# Altium project SPEC_A7.PrjPcb (part 3 of 7)

## Sheet VCXO_25M_PTP.SchDoc: SPEC-A7
size 420 x 297 mm; Author: G.Kasprowicz; CompanyName: WUT ISE; DrawnBy: G.Kasprowicz; Organization: WUT ISE; Address1: PW ISE; Address2: Nowowiejska 15/19 00-665 Warsaw; Address3: gkasprow@gmail.com; Revision: 2; SheetNumber: 8; SheetTotal: 18; ModifiedBy: -; CheckedDate: -; Title2: 25MHz VCXO; DivGrp: WUT ISE; Designer: G.Kasprowicz; ModifiedDate: -; ProjectName: Sensor Box
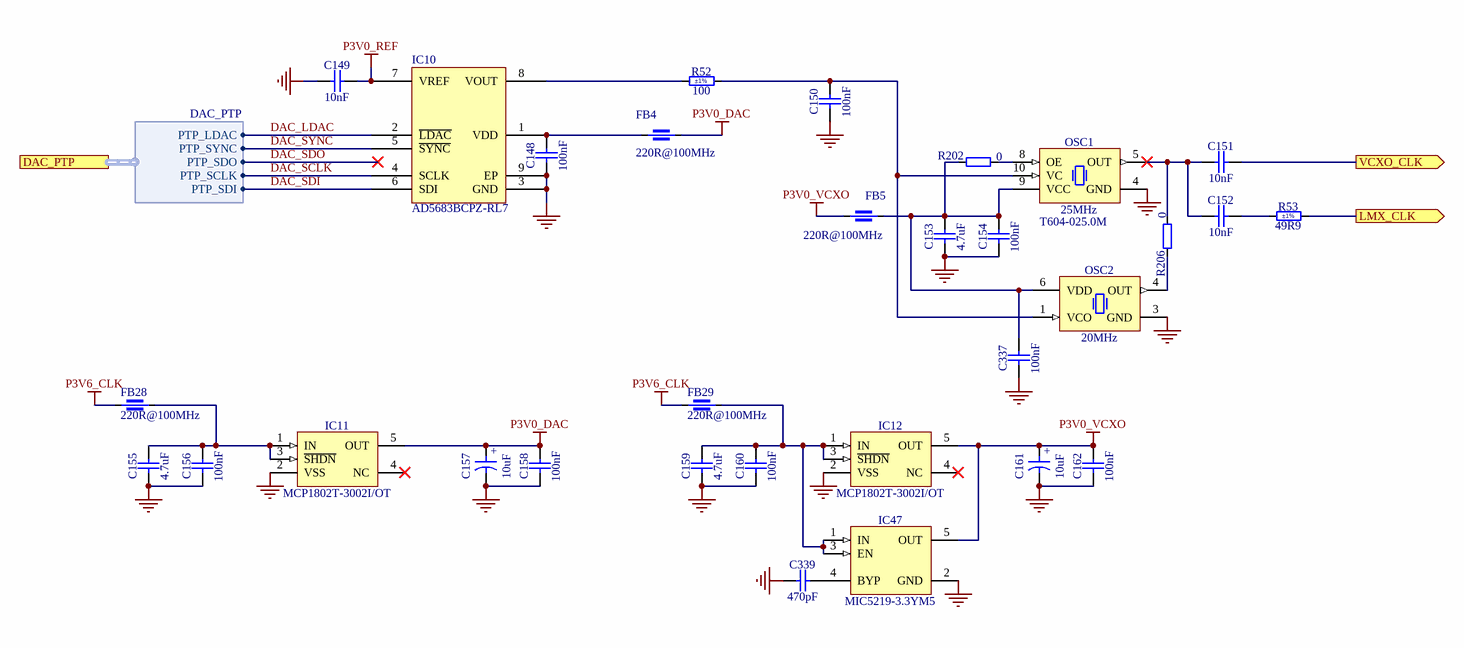
[diagram p5: VCXO_25M_PTP.SchDoc]

### Parts
C148  100nF  [CAPC0603X33N]
C149  10nF  [CAPC1005X55N]
C150  100nF  [CAPC2012X88N]
C151  10nF  [CAPC1005X55N]
C152  10nF  [CAPC1005X55N]
C153  4.7uF  [CAPC1005X55N]
C154  100nF  [CAPC0603X33N]
C155  4.7uF  [CAPC1005X55N]
C156  100nF  [CAPC0603X33N]
C157  10uF  [CAPMP3216X180N]
C158  100nF  [CAPC0603X33N]
C159  4.7uF  [CAPC1005X55N]
C160  100nF  [CAPC0603X33N]
C161  10uF  [CAPMP3216X180N]
C162  100nF  [CAPC0603X33N]
C337  100nF  [CAPC0603X33N]
C339  470pF  [CAPC1005X55N]
FB4  220R@100MHz  [INDC1608X95N]
FB5  220R@100MHz  [INDC1608X95N]
FB28  220R@100MHz  [INDC1608X95N]
FB29  220R@100MHz  [INDC1608X95N]
IC10  AD5683BCPZ-RL7  [SON50P200X60_HS-9N]
IC11  MCP1802T-3002I/OT  [SOT95P270X145-5N]
IC12  MCP1802T-3002I/OT  [SOT95P270X145-5N]
IC47  MIC5219-3.3YM5  [SOT95P280X145-5N]
OSC1  25MHz  Manufacturer Part Number: T604-025.0M  [OSC_CONNOR-WINFIELD_T]
OSC2  20MHz  [OSC_CONNOR-WINFIELD_DOT050V]
R52  100  Tolerance: ±1%  [RESC1005X40N]
R53  49R9  Tolerance: ±1%  [RESC1005X40N]
R202  0  [RESC1005X40N]
R206  0  [RESC1005X40N]

### Ports
DAC_PTP (harness DAC_PTP, see SPEC-A7-TOP[2C], FPGA_14_15[1E]), LMX_CLK (out, see SPEC-A7-TOP[2C], Clocks_PLL[1C]), VCXO_CLK (out, see SPEC-A7-TOP[2C])

### Harnesses
DAC_PTP: PTP_LDAC, PTP_SYNC, PTP_SCLK, PTP_SDI, PTP_SDO

### Nets
GND: C148.1 C149.1 C150.1 C153.1 C154.1 C155.1 C156.1 C157.2 C158.1 C159.1 C160.1 C161.2 C162.1 C337.1 C339.1 IC10.3(GND) IC10.9(EP) IC11.2(VSS) IC12.2(VSS) IC47.2(GND) OSC1.4(GND) OSC2.3(GND)
P3V0_DAC: C157.1 C158.2 FB4.1 IC11.5(OUT)
P3V0_REF: C149.2 IC10.7(VREF)
P3V0_VCXO: C161.1 C162.2 FB5.1 IC12.5(OUT) IC47.5(OUT)
P3V6_CLK: FB28.2 FB29.2
CLK_25M: C151.2 ; port VCXO_CLK
DAC_LDAC: IC10.2(~{LDAC}) ; port DAC_PTP.PTP_LDAC
DAC_SCLK: IC10.4(SCLK) ; port DAC_PTP.PTP_SCLK
DAC_SDI: IC10.6(SDI) ; port DAC_PTP.PTP_SDI
DAC_SYNC: IC10.5(~{SYNC}) ; port DAC_PTP.PTP_SYNC
NetC148_2: C148.2 FB4.2 IC10.1(VDD)
NetC150_2: C150.2 OSC1.10(VC) OSC2.1(VCO) R52.2
NetC151_1: C151.1 C152.1 OSC1.5(OUT) R206.2
NetC152_2: C152.2 R53.1
NetC153_2: C153.2 C154.2 C337.2 FB5.2 OSC1.9(VCC) OSC2.6(VDD) R202.1
NetC155_2: C155.2 C156.2 FB28.1 IC11.1(IN) IC11.3(~{SHDN})
NetC159_2: C159.2 C160.2 FB29.1 IC12.1(IN) IC12.3(~{SHDN}) IC47.1(IN) IC47.3(EN)
NetC339_2: C339.2 IC47.4(BYP)
NetIC10_8: IC10.8(VOUT) R52.1
NetIC16_8: R53.2 ; port LMX_CLK
NetOSC1_8: OSC1.8(OE) R202.2
NetOSC2_4: OSC2.4(OUT) R206.1

Not connected (* = marked no-connect by the designer): IC11 4(NC)*; IC12 4(NC)*

### Notes on the sheet
- Project/Equipment
- Document
- Designer
- Drawn by
- Check.by
- Copyright WUT ISE 2024.
  This documentation describes Open Hardware and is licensed under the CERN OHL v.2. You may redistribute and modify this documentation under the terms of the CERN OHL v.2. (http://ohwr.org/CERNOHL). This documentation is distributed WITHOUT ANY EXPRESS OR IMPLIED WARRANTY, INCLUDING OF MERCHANTABILITY, SATISFACTORY QUALITY AND FITNESS FOR A PARTICULAR PURPOSE. Please see the CERN OHL v.2 for applicable conditions.
- Contact
- File
- Last Mod.
- Print Date
- Sheet
- Size
- A3
- of
- Rev
- (in symbol CTE3216-18_10UF_10V_10%_LESR1800) +

### Library data of the parts
C148 C154 C156 C158 C160 C162 C337 = CC0201_100NF_6.3V_10%_X5R: Non-polarised capacitor; Part Description: SMD Multilayer Chip Ceramic Capacitor; Manufacturer: GENERIC; Manufacturer1 Part Number: 02016D104KAT2A; Voltage: 6.3V; TC: X5R; Tolerance: ±10%; Part Number: CC0201_100NF_6.3V_10%_X5R; Component Kind: Standard; Component Type: Standard; Pin Count: 2; Value: 100nF; Status: Not Recommended; Manufacturer Part Number: CC0201_100NF_6.3V_10%_X5R; Case: 0201; Mounted: Yes; Socket: No; SMD: Yes; Sense: No; Manufacturer1 Example: AVX; Manufacturer1 ComponentHeight: 0.33mm; HelpURL: \\cern.ch\dfs\Applications\Altium\Datasheets\CC0201_X5R_AVX.pdf; Author: CERN DEM JLC; CreateDate: 03.12.2007; LatestRevisionDate: 03.12.2007
C149 C151 C152 = CC0402_10NF_16V_10%_X7R: Non-polarised capacitor; Part Description: SMD Multilayer Chip Ceramic Capacitor; Manufacturer: GENERIC; Manufacturer1 Part Number: 223878715636; Voltage: 16V; TC: X7R; Tolerance: ±10%; Part Number: CC0402_10NF_16V_10%_X7R; Component Kind: Standard; Component Type: Standard; Pin Count: 2; Value: 10nF; Status: Not Recommended; Manufacturer Part Number: CC0402_10NF_16V_10%_X7R; Case: 0402; Mounted: Yes; Socket: No; SMD: Yes; Sense: No; Manufacturer1 Example: PHYCOMP; Manufacturer1 ComponentHeight: 0.55mm; HelpURL: \\cern.ch\dfs\Applications\Altium\Datasheets\CC0402_X7R_PHYCOMP.pdf; Author: CERN DEM JLC; CreateDate: 03.12.2007; LatestRevisionDate: 03.12.2007
C150 = CC0805_100NF_50V_1%_NP0: Non-polarised capacitor; Part Description: SMD Multilayer Chip Ceramic Capacitor; Manufacturer: GENERIC; Manufacturer1 Part Number: 0805N103F500C; Voltage: 50V; TC: C0G/NP0; Tolerance: ±1%; Part Number: CC0805_100NF_50V_1%_NP0; Component Kind: Standard; Component Type: Standard; Footprint: CAPC2012X135N; Pin Count: 2; Value: 100nF; Status: Not Recommended; Manufacturer Part Number: CC0805_100NF_50V_1%_NP0; Case: 0805; Mounted: Yes; Socket: No; SMD: Yes; Sense: No; Manufacturer1 Example: WALSIN TECHNOLOGY CORPORATION; Manufacturer1 ComponentHeight: 1.35mm; HelpURL: \\cern.ch\dfs\Applications\Altium\Datasheets\CC0805_WALSIN_0805.pdf; Author: CERN DEM HF; CreateDate: 28.08.2023; LatestRevisionDate: 28.08.2023; ComponentHeight: 1.35mm
C153 C155 C159 = CC0402_4.7UF_6.3V_20%_X5R: Non-polarised capacitor; Part Description: SMD Multilayer Chip Ceramic Capacitor; Manufacturer: GENERIC; Manufacturer1 Part Number: C1005X5R0J475M050BC; Voltage: 6.3V; TC: X5R; Tolerance: ±20%; Part Number: CC0402_4.7UF_6.3V_20%_X5R; Component Kind: Standard; Component Type: Standard; Pin Count: 2; Value: 4.7uF; Status: Preferred; Manufacturer Part Number: CC0402_4.7UF_6.3V_20%_X5R; Case: 0402; Mounted: Yes; Socket: No; SMD: Yes; Sense: No; Manufacturer1 Example: TDK; Manufacturer1 ComponentHeight: 0.65mm; HelpURL: \\cern.ch\dfs\Applications\Altium\Datasheets\CC0402_X5R_TDK_C.pdf; Author: CERN DEM JLC; CreateDate: 03.03.2015; LatestRevisionDate: 03.03.2015
C157 C161 = CTE3216-18_10UF_10V_10%_LESR1800: Polarised capacitor; Part Description: Low ESR 1R8 Solid Tantalum Chip Capacitor; Manufacturer: GENERIC; Manufacturer1 Part Number: TPSA106K010R1800; Voltage: 10V; Tolerance: ±10%; Part Number: CTE3216-18_10UF_10V_10%_LESR1800; Component Kind: Standard; Component Type: Standard; Pin Count: 2; Value: 10uF; Status: Preferred; Manufacturer Part Number: CTE3216-18_10UF_10V_10%_LESR1800; Case: A; Mounted: Yes; Socket: No; SMD: Yes; Sense: No; Manufacturer1 Example: AVX; Manufacturer1 ComponentHeight: 1.8mm; HelpURL: \\cern.ch\dfs\Applications\Altium\Datasheets\CTE-LESR_AVX_TPS.pdf; Author: CERN DEM JLC; CreateDate: 05.05.2008; LatestRevisionDate: 20.01.2009
C339 = CC0402_470PF_50V_10%_X7R: Non-polarised capacitor; Part Description: SMD Multilayer Chip Ceramic Capacitor; Manufacturer: GENERIC; Manufacturer1 Part Number: 223858715618; Voltage: 50V; TC: X7R; Tolerance: ±10%; Part Number: CC0402_470PF_50V_10%_X7R; Component Kind: Standard; Component Type: Standard; Pin Count: 2; Value: 470pF; Status: Not Recommended; Manufacturer Part Number: CC0402_470PF_50V_10%_X7R; Case: 0402; Mounted: Yes; Socket: No; SMD: Yes; Sense: No; Manufacturer1 Example: PHYCOMP; Manufacturer1 ComponentHeight: 0.55mm; HelpURL: \\cern.ch\dfs\Applications\Altium\Datasheets\CC0402_NP0_PHYCOMP.pdf; Author: CERN DEM JLC; CreateDate: 03.12.2007; LatestRevisionDate: 03.12.2007
FB4 FB5 FB28 FB29 = IND0603_MURATA_BLM18SG221TN1: as FB18-FB24 on sheet DIFF_DELAY_FANOUT; Part Number: IND0603_MURATA_BLM18SG221TN1; Component Kind: Standard; Component Type: Standard; Pin Count: 2; Value: 220R@100MHz; Manufacturer Part Number: BLM18SG221TN1; Case: 0603; Mounted: Yes; Socket: No; SMD: Yes; Sense: No; ComponentHeight: 0.95mm; HelpURL: \\cern.ch\dfs\Applications\Altium\Datasheets\IND0603_MURATA_BLM18S.pdf; Author: CERN DEM MR; CreateDate: 08.01.2016; LatestRevisionDate: 25.10.2018
IC10 = CMP-016-00740-2: IC DAC 16BIT V-OUT 8LFCSP 16 Bit Digital to Analog Converter 1 8-LFCSP-UD (2x2); Manufacturer: Analog Devices; Max Supply Voltage: 5.5V; Min Supply Voltage: 2.7V; Mounting Technology: Surface Mount; Max Operating Temperature: 105°C; Min Operating Temperature: -40°C; Pins: 8; Manufacturer Part Number: AD5683BCPZ-RL7
IC11 IC12 = MCP1802T-3002I/OT: 300mA, High PSRR, Low Quiescent Current LDO; Part Description: 3V, 300mA, High PSRR, Low Quiescent Current LDO; Manufacturer: MICROCHIP TECHNOLOGY; PressFit: No; Bonding: No; Part Number: MCP1802T-3002I/OT; Component Kind: Standard; Component Type: Standard; Device: MCP1802T-3002I/OT; PackageDescription: SOT, 0.95mm Pitch; 5 Pin,1.55mm W X 2.90mm L X 1.45mm H body, IPC Medium Density; Manufacturer Part Number: MCP1802T-3002I/OT; Pin Count: 3; Case: SOT23-5; Mounted: Yes; Socket: No; SMD: Yes; Sense: No; ComponentHeight: 1.45mm; HelpURL: \\cern.ch\dfs\Applications\Altium\Datasheets\MCP1802T-3002I-OT.pdf; Author: CERN DEM JLC; CreateDate: 03.05.2012; LatestRevisionDate: 17.09.2014
IC47 = MIC5219-3.3YM5: 500mA Peak Output LDO Regulator; Part Description: 3.3V 500mA Peak Output Low Drop-Out  (LDO) Regulator; Manufacturer: MICROCHIP TECHNOLOGY; PressFit: No; Bonding: No; Part Number: MIC5219-3.3YM5; Component Kind: Standard; Component Type: Standard; Device: MIC5219-3.3YM5; PackageDescription: SOT, 0.95mm pitch; 5 pin, 1.60mm W X 2.90mm L X 1.45mm H body, IPC Medium Density; Manufacturer Part Number: MIC5219-3.3YM5; Pin Count: 5; Case: SOT23-5; Mounted: Yes; Socket: No; SMD: Yes; Sense: No; ComponentHeight: 1.45mm; HelpURL: \\cern.ch\dfs\Applications\Altium\Datasheets\MIC5219-3.3YM5.pdf; Author: CERN DEM WB; CreateDate: 2019-04-16; LatestRevisionDate: 2019-04-16
OSC1 = OSC_25MHZ_CONNOR-WINFIELD_T604-025.0M: Oscillator 4 pins 4=GND 5=OUT 8=OE 9=VCC 10=VC; Part Description: 3.3V, ±0.28ppm, 15pF, -40°C to 85°C, LVCMOS,  Precision Tri-State Surface Mount VCTCXO, T Series; PressFit: No; Bonding: No; Part Number: OSC_25MHZ_CONNOR-WINFIELD_T604-025.0M; Component Kind: Standard; Component Type: Standard; PackageDescription: SMD VCTCXO, Side Concave, 10 Pins, 5.00x7.00mm, T Series; Value: 25MHz; Manufacturer: CONNOR-WINFIELD; Pin Count: 10; Mounted: Yes; Socket: No; SMD: Yes; Sense: No; ComponentHeight: 2.4mm; HelpURL: \\cern.ch\dfs\Applications\Altium\Datasheets\OSC_CONNOR-WINFIELD_T.pdf; Author: CERN DEM MR; CreateDate: 12.09.2016; LatestRevisionDate: 22.04.2021
OSC2 = OSC_20MHZ_CONNOR-WINFIELD_DOT050V-020.0M: Oscillator 4 pins 1=VCO 3=GND 4=OUT 6=VCC; Part Description: 3.3V, ±0.05ppm, 15pF, 0 to 70°C, LVCMOS, Precision Surface Mount VCTCXO Temperature Compensated Crystal Oscillator, DOT050V Series; PressFit: No; Bonding: No; Part Number: OSC_20MHZ_CONNOR-WINFIELD_DOT050V-020.0M; Component Kind: Standard; Component Type: Standard; PackageDescription: SMD VCTCXO, Side Concave, 6 Pins, 9.00mm x 14.0mm, DOT050V Series; Value: 20MHz; Manufacturer: CONNOR-WINFIELD; Manufacturer Part Number: DOT050V-020.0M; Pin Count: 6; Mounted: Yes; Socket: No; SMD: Yes; Sense: No; ComponentHeight: 6.86mm; HelpURL: \\cern.ch\dfs\Applications\Altium\Datasheets\OSC_CONNOR-WINFIELD_DOT050V.pdf; Author: CERN DEM BC; CreateDate: 04.11.2016; LatestRevisionDate: 04.11.2016
R52 = R0402_100R_1%_0.0625W_100PPM: Resistor - 1%; Part Description: General Purpose Thick Film Chip Resistor; Manufacturer: GENERIC; Manufacturer1 Part Number: 232270671001L; TC: ±100ppm/°C; PressFit: No; Part Number: R0402_100R_1%_0.0625W_100PPM; Component Kind: Standard; Component Type: Standard; Pin Count: 2; Value: 100; Status: Not Recommended; Power: 0.0625W; Manufacturer Part Number: R0402_100R_1%_0.0625W_100PPM; Case: 0402; Mounted: Yes; Sense: No; Socket: No; SMD: Yes; Manufacturer1 Example: YAGEO PHYCOMP; Manufacturer1 ComponentHeight: 0.4mm; HelpURL: \\cern.ch\dfs\Applications\Altium\Datasheets\R0402_Phycomp_RC0402.pdf; Author: CERN DEM JLC; CreateDate: 03.12.2007; LatestRevisionDate: 17.10.2012
R53 = R0402_49R9_1%_0.0625W_100PPM: Resistor - 1%; Part Description: General Purpose Thick Film Chip Resistor; Manufacturer: GENERIC; Manufacturer1 Part Number: 232270674999L or RC0402FR-0749R9L; TC: ±100ppm/°C; PressFit: No; Part Number: R0402_49R9_1%_0.0625W_100PPM; Component Kind: Standard; Component Type: Standard; Pin Count: 2; Value: 49R9; Status: Not Recommended; Power: 0.0625W; Manufacturer Part Number: R0402_49R9_1%_0.0625W_100PPM; Case: 0402; Mounted: Yes; Sense: No; Socket: No; SMD: Yes; Manufacturer1 Example: YAGEO PHYCOMP; Manufacturer1 ComponentHeight: 0.4mm; HelpURL: \\cern.ch\dfs\Applications\Altium\Datasheets\R0402_Phycomp_RC0402.pdf; Author: CERN DEM JLC; CreateDate: 24.10.2012; LatestRevisionDate: 24.10.2012
R202 R206 = R0402_0R_JUMPER: as R137-R144 on sheet DIFF_DELAY_FANOUT; Part Number: R0402_0R_JUMPER; Component Kind: Standard; Component Type: Standard; Pin Count: 2; Value: 0; Status: Not Recommended; Manufacturer Part Number: R0402_0R_JUMPER; Case: 0402; Mounted: Yes; Sense: No; Socket: No; SMD: Yes; Manufacturer1 Example: YAGEO PHYCOMP; Manufacturer1 ComponentHeight: 0.4mm; HelpURL: \\cern.ch\dfs\Applications\Altium\Datasheets\R0402_Phycomp_RC0402.pdf; Author: CERN DEM JLC; CreateDate: 03.12.2007; LatestRevisionDate: 17.10.2012

## Sheet SFP.SchDoc: SPEC-A7
size 420 x 297 mm; Author: G.Kasprowicz; CompanyName: WUT ISE; DrawnBy: G.Kasprowicz; Organization: WUT ISE; Address1: PW ISE; Address2: Nowowiejska 15/19 00-665 Warsaw; Address3: gkasprow@gmail.com; Revision: 2; SheetNumber: 12; SheetTotal: 18; ModifiedBy: -; CheckedDate: -; Title2: SFPs; DivGrp: WUT ISE; Designer: G.Kasprowicz; ModifiedDate: -; ProjectName: Sensor Box
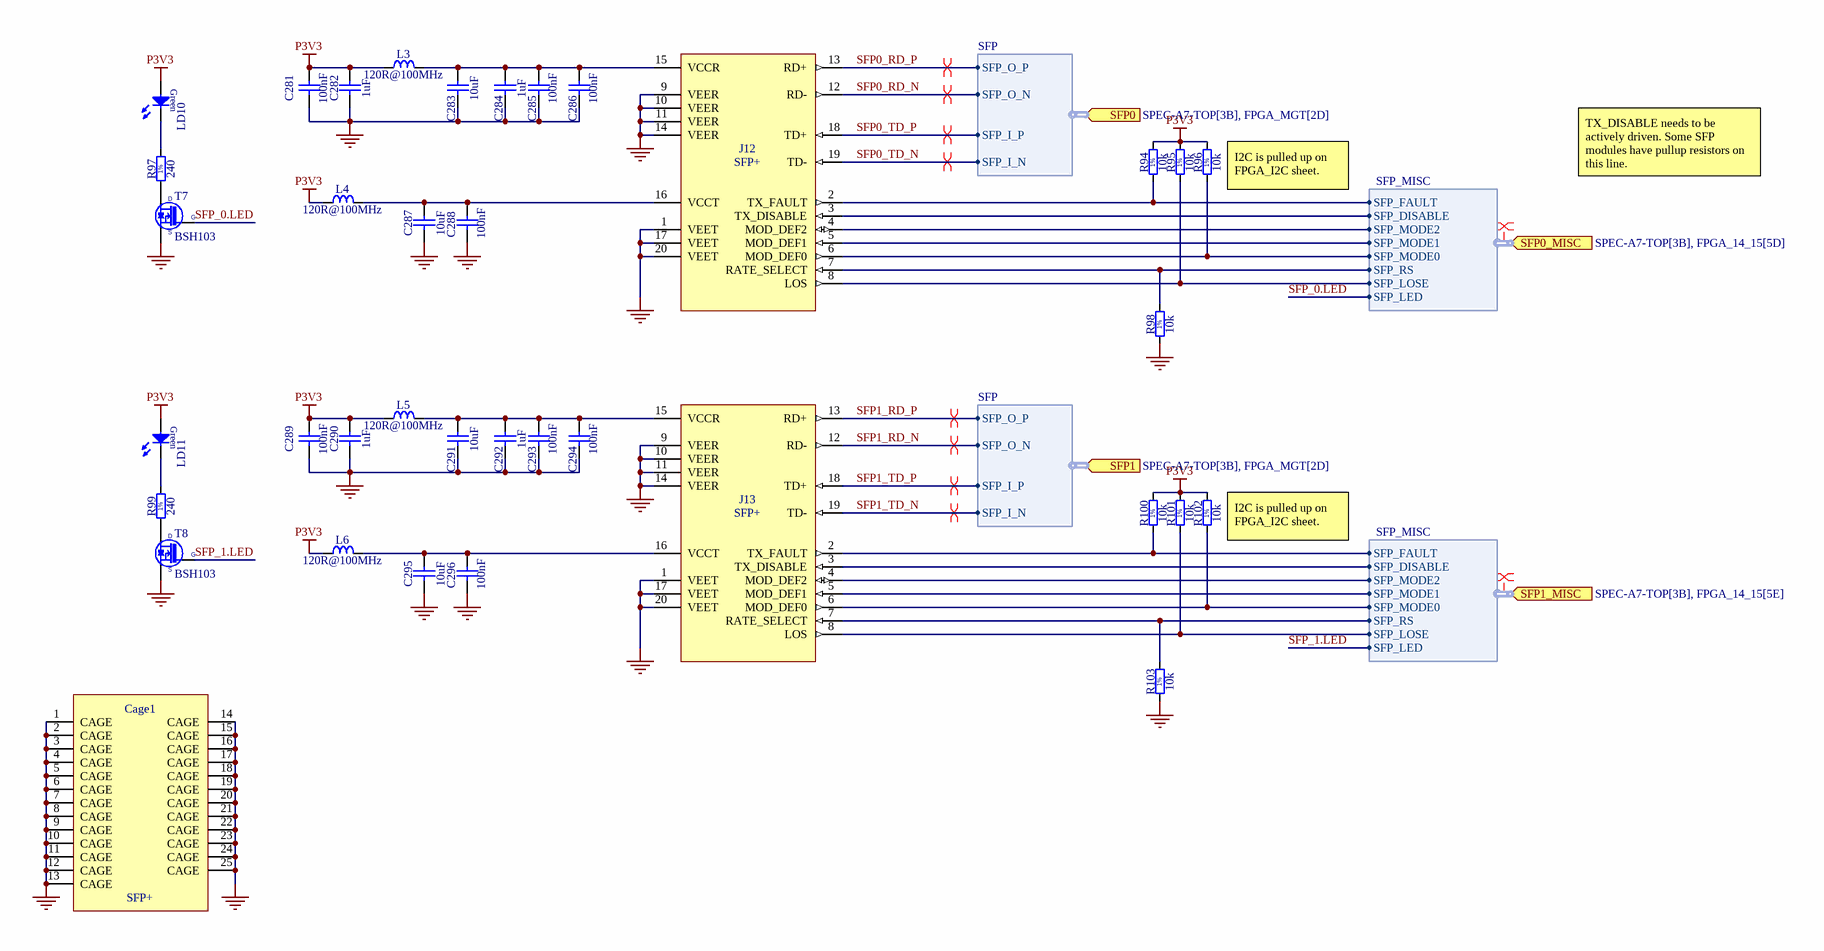
[diagram p6: SFP.SchDoc]

### Parts
C281  100nF  [CAPC0603X33N]
C282  1uF  [CAPC1005X55N]
C283  10uF  [CAPC1608X80N]
C284  1uF  [CAPC1005X55N]
C285  100nF  [CAPC0603X33N]
C286  100nF  [CAPC0603X33N]
C287  10uF  [CAPC1608X80N]
C288  100nF  [CAPC0603X33N]
C289  100nF  [CAPC0603X33N]
C290  1uF  [CAPC1005X55N]
C291  10uF  [CAPC1608X80N]
C292  1uF  [CAPC1005X55N]
C293  100nF  [CAPC0603X33N]
C294  100nF  [CAPC0603X33N]
C295  10uF  [CAPC1608X80N]
C296  100nF  [CAPC0603X33N]
Cage1  SFP+  [TYCO_2007263-1]
J12  SFP+  [MOLEX_74441-0001]
J13  SFP+  [MOLEX_74441-0001]
L3  120R@100MHz  [INDC1608X65N]
L4  120R@100MHz  [INDC1608X65N]
L5  120R@100MHz  [INDC1608X65N]
L6  120R@100MHz  [INDC1608X65N]
LD10  Green  [LED_AVAGO_HSME-C120]  (value not drawn)
LD11  Green  [LED_AVAGO_HSME-C120]  (value not drawn)
R94  10k  [RESC1005X40N]
R95  10k  [RESC1005X40N]
R96  10k  [RESC1005X40N]
R97  240  [RESC1005X40N]
R98  10k  [RESC1005X40N]
R99  240  [RESC1005X40N]
R100  10k  [RESC1005X40N]
R101  10k  [RESC1005X40N]
R102  10k  [RESC1005X40N]
R103  10k  [RESC1005X40N]
T7  BSH103  [SOT95P230X110-3N]
T8  BSH103  [SOT95P230X110-3N]

### Ports
SFP0 (in, harness SFP, see SPEC-A7-TOP[3B], FPGA_MGT[2D]), SFP0_MISC (in, harness SFP_MISC, see SPEC-A7-TOP[3B], FPGA_14_15[5D]), SFP1 (in, harness SFP, see SPEC-A7-TOP[3B], FPGA_MGT[2D]), SFP1_MISC (in, harness SFP_MISC, see SPEC-A7-TOP[3B], FPGA_14_15[5E])

### Harnesses
SFP_MISC: SFP_FAULT, SFP_DISABLE, SFP_MODE2, SFP_MODE1, SFP_MODE0, SFP_RS, SFP_LOSE, SFP_LED
SFP: SFP_O_P, SFP_O_N, SFP_I_P, SFP_I_N

### Nets
GND: C281.1 C282.1 C283.1 C284.1 C285.1 C286.1 C287.1 C288.1 C289.1 C290.1 C291.1 C292.1 C293.1 C294.1 C295.1 C296.1 Cage1.1(CAGE) Cage1.2(CAGE) Cage1.3(CAGE) Cage1.4(CAGE) Cage1.5(CAGE) Cage1.6(CAGE) Cage1.7(CAGE) Cage1.8(CAGE) Cage1.9(CAGE) Cage1.10(CAGE) Cage1.11(CAGE) Cage1.12(CAGE) Cage1.13(CAGE) Cage1.14(CAGE) Cage1.15(CAGE) Cage1.16(CAGE) Cage1.17(CAGE) Cage1.18(CAGE) Cage1.19(CAGE) Cage1.20(CAGE) Cage1.21(CAGE) Cage1.22(CAGE) Cage1.23(CAGE) Cage1.24(CAGE) Cage1.25(CAGE) J12.1(VEET) J12.9(VEER) J12.10(VEER) J12.11(VEER) J12.14(VEER) J12.17(VEET) J12.20(VEET) J13.1(VEET) J13.9(VEER) J13.10(VEER) J13.11(VEER) J13.14(VEER) J13.17(VEET) J13.20(VEET) R98.1 R103.1 T7.2(S) T8.2(S)
P3V3: C281.2 C282.2 C289.2 C290.2 L3.1 L4.1 L5.1 L6.1 LD10.2(A) LD11.2(A) R94.2 R95.2 R96.2 R100.2 R101.2 R102.2
SFP0_DISABLE: J12.3(TX_DISABLE) ; port SFP0_MISC.SFP_DISABLE
SFP0_FAULT: J12.2(TX_FAULT) R94.1 ; port SFP0_MISC.SFP_FAULT
SFP0_LOSE: J12.8(LOS) R95.1 ; port SFP0_MISC.SFP_LOSE
SFP0_MODE0: J12.6(MOD_DEF0) R96.1 ; port SFP0_MISC.SFP_MODE0
SFP0_MODE1: J12.5(MOD_DEF1) ; port SFP0_MISC.SFP_MODE1
SFP0_MODE2: J12.4(MOD_DEF2) ; port SFP0_MISC.SFP_MODE2
SFP0_RD_N: J12.12(RD-) ; port SFP0.SFP_O_N  [project net SFP0_O_N]
SFP0_RD_P: J12.13(RD+) ; port SFP0.SFP_O_P  [project net SFP0_O_P]
SFP0_RS: J12.7(RATE_SELECT) R98.2 ; port SFP0_MISC.SFP_RS
SFP0_TD_N: J12.19(TD-) ; port SFP0.SFP_I_N  [project net SFP0_I_N]
SFP0_TD_P: J12.18(TD+) ; port SFP0.SFP_I_P  [project net SFP0_I_P]
SFP1_DISABLE: J13.3(TX_DISABLE) ; port SFP1_MISC.SFP_DISABLE
SFP1_FAULT: J13.2(TX_FAULT) R100.1 ; port SFP1_MISC.SFP_FAULT
SFP1_LOSE: J13.8(LOS) R101.1 ; port SFP1_MISC.SFP_LOSE
SFP1_MODE0: J13.6(MOD_DEF0) R102.1 ; port SFP1_MISC.SFP_MODE0
SFP1_MODE1: J13.5(MOD_DEF1) ; port SFP1_MISC.SFP_MODE1
SFP1_MODE2: J13.4(MOD_DEF2) ; port SFP1_MISC.SFP_MODE2
SFP1_RD_N: J13.12(RD-) ; port SFP1.SFP_O_N  [project net SFP1_O_N]
SFP1_RD_P: J13.13(RD+) ; port SFP1.SFP_O_P  [project net SFP1_O_P]
SFP1_RS: J13.7(RATE_SELECT) R103.2 ; port SFP1_MISC.SFP_RS
SFP1_TD_N: J13.19(TD-) ; port SFP1.SFP_I_N  [project net SFP1_I_N]
SFP1_TD_P: J13.18(TD+) ; port SFP1.SFP_I_P  [project net SFP1_I_P]
SFP_0.LED: T7.1(G) ; port SFP0_MISC.SFP_LED
SFP_1.LED: T8.1(G) ; port SFP1_MISC.SFP_LED
NetC283_2: C283.2 C284.2 C285.2 C286.2 J12.15(VCCR) L3.2
NetC287_2: C287.2 C288.2 J12.16(VCCT) L4.2
NetC291_2: C291.2 C292.2 C293.2 C294.2 J13.15(VCCR) L5.2
NetC295_2: C295.2 C296.2 J13.16(VCCT) L6.2
NetLD10_1: LD10.1(C) R97.2
NetLD11_1: LD11.1(C) R99.2
NetR97_1: R97.1 T7.3(D)
NetR99_1: R99.1 T8.3(D)

### Layout directives
differential pair; differential pair class Diff_100Ohm: SFP0_I_N, SFP0_I_P, SFP0_O_N, SFP0_O_P, SFP1_I_N, SFP1_I_P, SFP1_O_N, SFP1_O_P
net class SFP0: (no net found under the mark)
net class SFP1: (no net found under the mark)

### Notes on the sheet
- (near R96) I2C is pulled up on FPGA_I2C sheet.
- TX_DISABLE needs to be actively driven. Some SFP modules have pullup resistors on this line.
- (near R102) I2C is pulled up on FPGA_I2C sheet.
- Project/Equipment
- Document
- Designer
- Drawn by
- Check.by
- Copyright WUT ISE 2024.
  This documentation describes Open Hardware and is licensed under the CERN OHL v.2. You may redistribute and modify this documentation under the terms of the CERN OHL v.2. (http://ohwr.org/CERNOHL). This documentation is distributed WITHOUT ANY EXPRESS OR IMPLIED WARRANTY, INCLUDING OF MERCHANTABILITY, SATISFACTORY QUALITY AND FITNESS FOR A PARTICULAR PURPOSE. Please see the CERN OHL v.2 for applicable conditions.
- Contact
- File
- Last Mod.
- Print Date
- Sheet
- Size
- A3
- of
- Rev
- (in symbol R0402_10K_1%_0.0625W_100PPM) 1%
- (in symbol R0402_240R_1%_0.0625W_100PPM) 1%

### Library data of the parts
C281 C285 C286 C288 C289 C293 C294 C296 = CC0201_100NF_6.3V_10%_X5R: as C148 on sheet VCXO_25M_PTP; Part Number: CC0201_100NF_6.3V_10%_X5R; Component Kind: Standard; Component Type: Standard; Pin Count: 2; Value: 100nF; Status: Not Recommended; Manufacturer Part Number: CC0201_100NF_6.3V_10%_X5R; Case: 0201; Mounted: Yes; Socket: No; SMD: Yes; Sense: No; Manufacturer1 Example: AVX; Manufacturer1 ComponentHeight: 0.33mm; HelpURL: \\cern.ch\dfs\Applications\Altium\Datasheets\CC0201_X5R_AVX.pdf; Author: CERN DEM JLC; CreateDate: 2007-12-03; LatestRevisionDate: 2007-12-03
C282 C284 C290 C292 = CC0402_1UF_16V_10%_X5R: Non-polarised capacitor; Part Description: SMD Multilayer Chip Ceramic Capacitor; Manufacturer: GENERIC; Manufacturer1 Part Number: C1005X5R1C105KT; Voltage: 16V; TC: X5R; Tolerance: ±10%; Part Number: CC0402_1UF_16V_10%_X5R; Component Kind: Standard; Component Type: Standard; Pin Count: 2; Value: 1uF; Status: Preferred; Manufacturer Part Number: CC0402_1UF_16V_10%_X5R; Case: 0402; Mounted: Yes; Socket: No; SMD: Yes; Sense: No; Manufacturer1 Example: TDK; Manufacturer1 ComponentHeight: 0.55mm; HelpURL: \\cern.ch\dfs\Applications\Altium\Datasheets\CC0402_X5R_TDK_C.pdf; Author: CERN DEM JLC; CreateDate: 2012-10-25; LatestRevisionDate: 2012-10-25
C283 C287 C291 C295 = CC0603_10UF_16V_20%_X5R: Non-polarised capacitor; Part Description: SMD Multilayer Chip Ceramic Capacitor; Manufacturer: GENERIC; Manufacturer1 Part Number: GRM188R61C106MA73D; Voltage: 16V; TC: X5R; Tolerance: ±20%; Part Number: CC0603_10UF_16V_20%_X5R; Component Kind: Standard; Component Type: Standard; Pin Count: 2; Value: 10uF; Status: None; Manufacturer Part Number: CC0603_10UF_16V_20%_X5R; Case: 0603; Mounted: Yes; Socket: No; SMD: Yes; Sense: No; Manufacturer1 Example: MURATA; Manufacturer1 ComponentHeight: 0.8mm; HelpURL: \\cern.ch\dfs\Applications\Altium\Datasheets\CC0603_X5R_MURATA_GRM.pdf; Author: CERN DEM MR; CreateDate: 02.03.2016; LatestRevisionDate: 02.03.2016
Cage1 = TYCO_2007263-1: SFP 1x2 Cage (25Pins); Part Description: 1x2 Press Fit SFP+ Cage with EMI Springs; Manufacturer: TYCO ELECTRONICS; Part Number: TYCO_2007263-1; Component Kind: Standard; Component Type: Standard; Pin Count: 25; Family: SFP+; Mounted: Yes; Socket: No; SMD: No; PressFit: Yes; Sense: No; Status: None; Manufacturer Part Number: 2007263-1; ComponentHeight: 9.7mm; HelpURL: \\cern.ch\dfs\Applications\Altium\Datasheets\TYCO_2007263-1.pdf; Author: CERN DEM JLC; CreateDate: 18.01.2017; LatestRevisionDate: 18.01.2017
J12 J13 = MOLEX_74441-0001: 20 Position SFP  Connector (Small Form-factor Pluggable); Part Description: 20 Position, Pitch 0.8mm SFP Receptacle (Small Form-factor Pluggable); Manufacturer: MOLEX; PressFit: No; Part Number: MOLEX_74441-0001; Component Kind: Standard; Component Type: Standard; Pin Count: 20; Family: SFP+; Mounted: Yes; Socket: No; SMD: Yes; Sense: No; Status: None; Manufacturer Part Number: 74441-0001; ComponentHeight: 5.4mm; HelpURL: \\cern.ch\dfs\Applications\Altium\Datasheets\MOLEX_74441-0001.pdf; ComponentLink1URL: \\cern.ch\dfs\Applications\Altium\Datasheets\MOLEX_SFP_Application.pdf; ComponentLink1Description: Application; Author: CERN DEM MR; CreateDate: 03.12.2015; LatestRevisionDate: 03.12.2015
L3-L6 = IND0603_MURATA_BLM18SG121TN1D: Inductor; Part Description: SMD EMIFIL Suppression Chip Ferrite Bead; Manufacturer: MURATA; Power: 3A; Resistance: 0.025R; Tolerance: ±25%; Part Number: IND0603_MURATA_BLM18SG121TN1D; Component Kind: Standard; Component Type: Standard; Pin Count: 2; Value: 120R@100MHz; Status: None; Manufacturer Part Number: BLM18SG121TN1D; Case: 0603; Mounted: Yes; Socket: No; SMD: Yes; Sense: No; ComponentHeight: 0.65mm; HelpURL: \\cern.ch\dfs\Applications\Altium\Datasheets\IND0603_MURATA_BLM18S.pdf; Author: CERN DEM JLC; CreateDate: 23.07.2014; LatestRevisionDate: 23.07.2014
LD10 LD11 = LED_AVAGO_HSME-C120: LED Green 1C 2A; Part Description: High Performance Right Angle Chip Green LED; Manufacturer: AVAGO TECHNOLOGIES; PressFit: No; Bonding: No; Part Number: LED_AVAGO_HSME-C120; Component Kind: Standard; Component Type: Standard; Color: Green; PackageDescription: Green Chip LED, 2-Leads, Body 1.7x1.1mm, Side Emitting Package; Manufacturer Part Number: HSME-C120; Pin Count: 2; Mounted: Yes; Socket: No; SMD: Yes; Sense: No; ComponentHeight: 0.7mm; HelpURL: \\cern.ch\dfs\Applications\Altium\Datasheets\LED_AVAGO_HSME-C120.pdf; ComponentLink1URL: \\cern.ch\dfs\Applications\Altium\Datasheets\LED_AVAGO_HSME-C110_DESIGN-GUIDE.pdf; ComponentLink1Description: Design Guide; Author: CERN DEM JMW; CreateDate: 22.07.2009; LatestRevisionDate: 20.06.2012
R94-R96 R98 R100-R103 = R0402_10K_1%_0.0625W_100PPM: Resistor - 1%; Part Description: General Purpose Thick Film Chip Resistor; Manufacturer: GENERIC; Manufacturer1 Part Number: 232270671003L; TC: ±100ppm/°C; PressFit: No; Part Number: R0402_10K_1%_0.0625W_100PPM; Component Kind: Standard; Component Type: Standard; Pin Count: 2; Value: 10k; Status: Not Recommended; Power: 0.0625W; Tolerance: ±1%; Manufacturer Part Number: R0402_10K_1%_0.0625W_100PPM; Case: 0402; Mounted: Yes; Sense: No; Socket: No; SMD: Yes; Manufacturer1 Example: YAGEO PHYCOMP; Manufacturer1 ComponentHeight: 0.4mm; HelpURL: \\cern.ch\dfs\Applications\Altium\Datasheets\R0402_Phycomp_RC0402.pdf; Author: CERN DEM JLC; CreateDate: 03.12.2007; LatestRevisionDate: 17.10.2012
R97 R99 = R0402_240R_1%_0.0625W_100PPM: Resistor - 1%; Part Description: General Purpose Thick Film Chip Resistor; Manufacturer: GENERIC; Manufacturer1 Part Number: 232270672401L; TC: ±100ppm/°C; PressFit: No; Part Number: R0402_240R_1%_0.0625W_100PPM; Component Kind: Standard; Component Type: Standard; Pin Count: 2; Value: 240; Status: Not Recommended; Power: 0.0625W; Tolerance: ±1%; Manufacturer Part Number: R0402_240R_1%_0.0625W_100PPM; Case: 0402; Mounted: Yes; Sense: No; Socket: No; SMD: Yes; Manufacturer1 Example: YAGEO PHYCOMP; Manufacturer1 ComponentHeight: 0.4mm; HelpURL: \\cern.ch\dfs\Applications\Altium\Datasheets\R0402_Phycomp_RC0402.pdf; Author: CERN DEM JLC; CreateDate: 03.12.2007; LatestRevisionDate: 17.10.2012
T7 T8 = BSH103: N-CHANNEL MOSFET WITH DIODE; Part Description: 30V 850mA N-Channel Enhancement Mode Field-Effect Transistor; Manufacturer: NEXPERIA; PressFit: No; Bonding: No; Part Number: BSH103; Component Kind: Standard; Component Type: Standard; Device: BSH103; PackageDescription: SOT23, 3 pin, Pitch 0.95mm - 1.3mm W X 2.9mm L X 1.1mm H, IPC Medium Density; Manufacturer Part Number: BSH103; Pin Count: 3; Case: SOT23-3; Mounted: Yes; Socket: No; SMD: Yes; Sense: No; ComponentHeight: 1.1mm; HelpURL: \\cern.ch\dfs\Applications\Altium\Datasheets\BSH103.pdf; Author: CERN DEM JLC; CreateDate: 16.03.2010; LatestRevisionDate: 20.06.2017

## Sheet FPGA_34.SchDoc: SPEC-A7
size 420 x 297 mm; Author: G.Kasprowicz; CompanyName: WUT ISE; DrawnBy: G.Kasprowicz; Organization: WUT ISE; Address1: PW ISE; Address2: Nowowiejska 15/19 00-665 Warsaw; Address3: gkasprow@gmail.com; Revision: 2; SheetNumber: 4; SheetTotal: 18; ModifiedBy: -; CheckedDate: -; Title2: FPGA 34; DivGrp: WUT ISE; Designer: G.Kasprowicz; ModifiedDate: -; ProjectName: Sensor Box
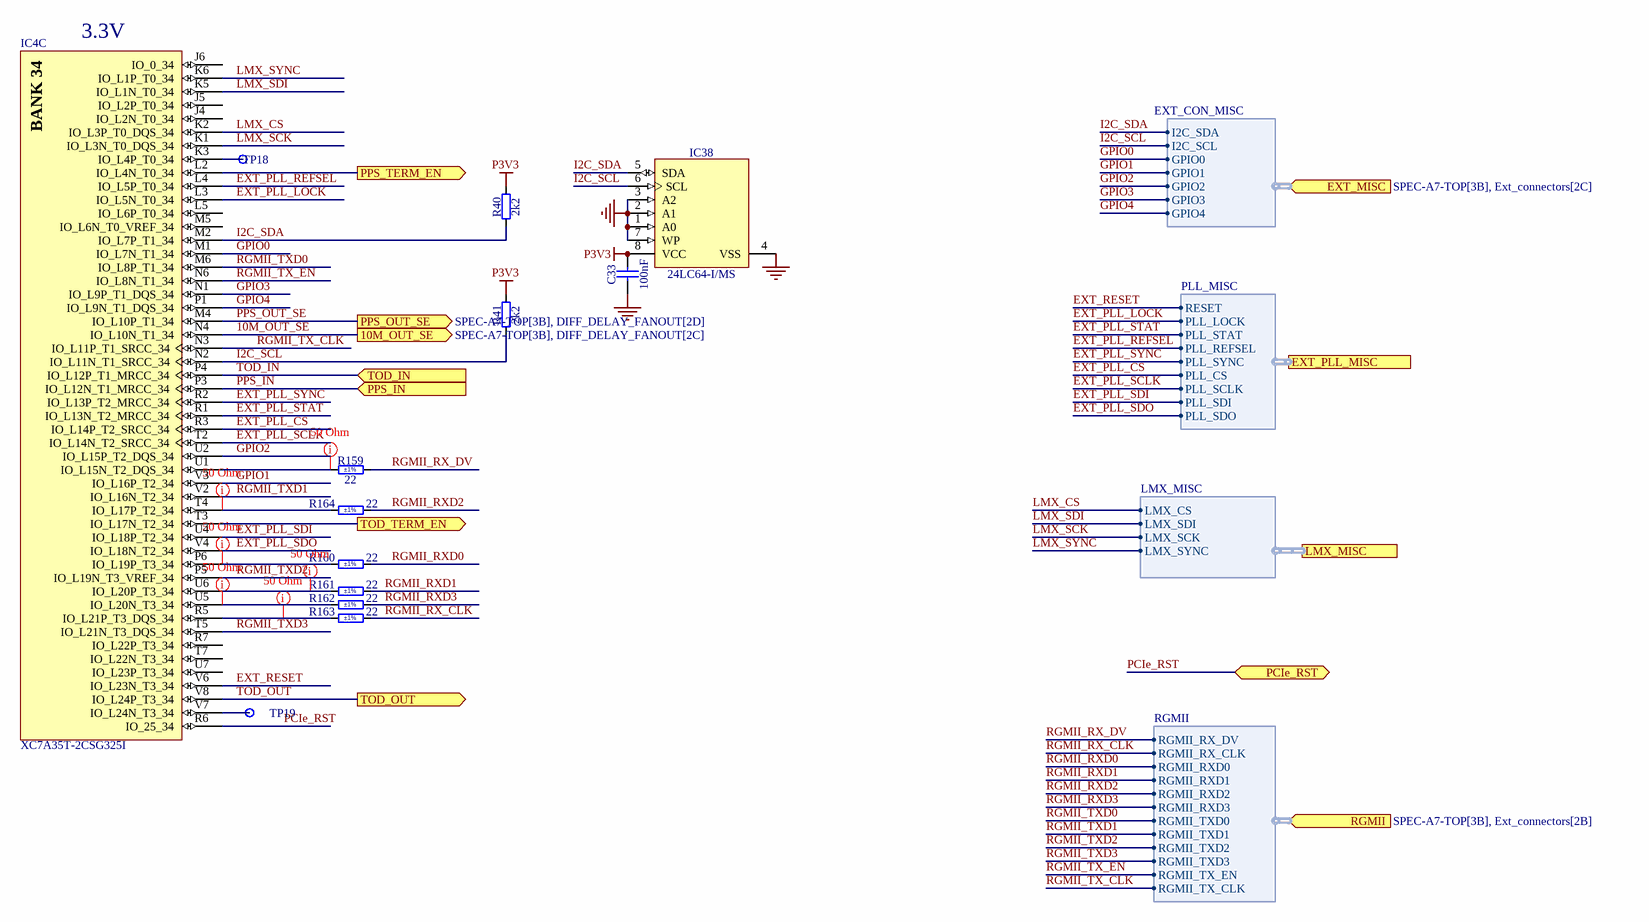
[diagram p7: FPGA_34.SchDoc]

### Parts
C33  100nF  [CAPC0603X33N]
IC4  XC7A35T-2CSG325I  [CSG325]  (part C of 9)
IC38  24LC64-I/MS  [SOP65P490X110-8N]
R40  2k2  [RESC1005X40N]
R41  2k2  [RESC1005X40N]
R159  22  Tolerance: ±1%  [RESC1005X40N]
R160  22  Tolerance: ±1%  [RESC1005X40N]
R161  22  Tolerance: ±1%  [RESC1005X40N]
R162  22  Tolerance: ±1%  [RESC1005X40N]
R163  22  Tolerance: ±1%  [RESC1005X40N]
R164  22  Tolerance: ±1%  [RESC1005X40N]
TP18  Test Point  [TPS060]  (value not drawn)
TP19  Test Point  [TPS060]  (value not drawn)

### Ports
10M_OUT_SE (out, see SPEC-A7-TOP[3B], DIFF_DELAY_FANOUT[2C]), EXT_MISC (in, harness EXT_CON_MISC, see SPEC-A7-TOP[3B], Ext_connectors[2C]), EXT_PLL_MISC (harness PLL_MISC, see SPEC-A7-TOP[3B], Clocks_PLL[5E]), LMX_MISC (harness LMX_MISC, see SPEC-A7-TOP[3B], Clocks_PLL[5D]), PCIe_RST (bidir, see SPEC-A7-TOP[3B], PCIe[1C]), PPS_IN (in, see SPEC-A7-TOP[3B], PPS_IN[4C]), PPS_OUT_SE (out, see SPEC-A7-TOP[3B], DIFF_DELAY_FANOUT[2D]), PPS_TERM_EN (out, see SPEC-A7-TOP[3B], PPS_IN[2D]), RGMII (in, harness RGMII, see SPEC-A7-TOP[3B], Ext_connectors[2B]), TOD_IN (in, see SPEC-A7-TOP[3B], TOD[3C]), TOD_OUT (out, see SPEC-A7-TOP[3B], TOD[3D]), TOD_TERM_EN (out, see SPEC-A7-TOP[3B], TOD[1C])

### Harnesses
PLL_MISC: RESET, PLL_LOCK, PLL_STAT, PLL_REFSEL, PLL_SYNC, PLL_CS, PLL_SCLK, PLL_SDI, PLL_SDO
LMX_MISC: LMX_CS, LMX_SDI, LMX_SCK, LMX_SYNC
EXT_CON_MISC: I2C_SDA, I2C_SCL, GPIO0, GPIO1, GPIO2, GPIO3, GPIO4
RGMII: RGMII_RX_DV, RGMII_RX_CLK, RGMII_RXD0, RGMII_RXD1, RGMII_RXD2, RGMII_RXD3, RGMII_TXD0, RGMII_TXD1, RGMII_TXD2, RGMII_TXD3, RGMII_TX_EN, RGMII_TX_CLK

### Nets
GND: C33.1 IC38.1(A0) IC38.2(A1) IC38.3(A2) IC38.4(VSS) IC38.7(WP)
P3V3: C33.2 IC38.8(VCC) R40.2 R41.2
10M_OUT_SE: IC4.N4(IO_L10N_T1_34) ; port 10M_OUT_SE
EXT_PLL_CS: IC4.R3(IO_L14P_T2_SRCC_34) ; port EXT_PLL_MISC.PLL_CS
EXT_PLL_LOCK: IC4.L3(IO_L5N_T0_34) ; port EXT_PLL_MISC.PLL_LOCK
EXT_PLL_REFSEL: IC4.L4(IO_L5P_T0_34) ; port EXT_PLL_MISC.PLL_REFSEL
EXT_PLL_SCLK: IC4.T2(IO_L14N_T2_SRCC_34) ; port EXT_PLL_MISC.PLL_SCLK
EXT_PLL_SDI: IC4.U4(IO_L18P_T2_34) ; port EXT_PLL_MISC.PLL_SDI
EXT_PLL_SDO: IC4.V4(IO_L18N_T2_34) ; port EXT_PLL_MISC.PLL_SDO
EXT_PLL_STAT: IC4.R1(IO_L13N_T2_MRCC_34) ; port EXT_PLL_MISC.PLL_STAT
EXT_PLL_SYNC: IC4.R2(IO_L13P_T2_MRCC_34) ; port EXT_PLL_MISC.PLL_SYNC
EXT_RESET: IC4.V6(IO_L23N_T3_34) ; port EXT_PLL_MISC.RESET
GPIO0: IC4.M1(IO_L7N_T1_34) ; port EXT_MISC.GPIO0
GPIO1: IC4.V3(IO_L16P_T2_34) ; port EXT_MISC.GPIO1
GPIO2: IC4.U2(IO_L15P_T2_DQS_34) ; port EXT_MISC.GPIO2
GPIO3: IC4.N1(IO_L9P_T1_DQS_34) ; port EXT_MISC.GPIO3
GPIO4: IC4.P1(IO_L9N_T1_DQS_34) ; port EXT_MISC.GPIO4
I2C_SCL: IC4.N2(IO_L11N_T1_SRCC_34) IC38.6(SCL) R41.1 ; port EXT_MISC.I2C_SCL
I2C_SDA: IC4.M2(IO_L7P_T1_34) IC38.5(SDA) R40.1 ; port EXT_MISC.I2C_SDA
LMX_CS: IC4.K2(IO_L3P_T0_DQS_34) ; port LMX_MISC.LMX_CS
LMX_SCK: IC4.K1(IO_L3N_T0_DQS_34) ; port LMX_MISC.LMX_SCK
LMX_SDI: IC4.K5(IO_L1N_T0_34) ; port LMX_MISC.LMX_SDI
LMX_SYNC: IC4.K6(IO_L1P_T0_34) ; port LMX_MISC.LMX_SYNC
PCIe_RST: IC4.R6(IO_25_34) ; port PCIe_RST
PPS_IN: IC4.P3(IO_L12N_T1_MRCC_34) ; port PPS_IN
PPS_OUT_SE: IC4.M4(IO_L10P_T1_34) ; port PPS_OUT_SE
RGMII_RX_CLK: R163.2 ; port RGMII.RGMII_RX_CLK
RGMII_RX_DV: R159.2 ; port RGMII.RGMII_RX_DV
RGMII_RXD0: R160.2 ; port RGMII.RGMII_RXD0
RGMII_RXD1: R161.2 ; port RGMII.RGMII_RXD1
RGMII_RXD2: R164.2 ; port RGMII.RGMII_RXD2
RGMII_RXD3: R162.2 ; port RGMII.RGMII_RXD3
RGMII_TX_CLK: IC4.N3(IO_L11P_T1_SRCC_34) ; port RGMII.RGMII_TX_CLK
RGMII_TX_EN: IC4.N6(IO_L8N_T1_34) ; port RGMII.RGMII_TX_EN
RGMII_TXD0: IC4.M6(IO_L8P_T1_34) ; port RGMII.RGMII_TXD0
RGMII_TXD1: IC4.V2(IO_L16N_T2_34) ; port RGMII.RGMII_TXD1
RGMII_TXD2: IC4.P5(IO_L19N_T3_VREF_34) ; port RGMII.RGMII_TXD2
RGMII_TXD3: IC4.T5(IO_L21N_T3_DQS_34) ; port RGMII.RGMII_TXD3
TOD_IN: IC4.P4(IO_L12P_T1_MRCC_34) ; port TOD_IN
TOD_OUT: IC4.V8(IO_L24P_T3_34) ; port TOD_OUT
NetIC4_K3: IC4.K3(IO_L4P_T0_34) TP18.1
NetIC4_L2: IC4.L2(IO_L4N_T0_34) ; port PPS_TERM_EN
NetIC4_P6: IC4.P6(IO_L19P_T3_34) R160.1
NetIC4_R5: IC4.R5(IO_L21P_T3_DQS_34) R163.1
NetIC4_T3: IC4.T3(IO_L17N_T2_34) ; port TOD_TERM_EN
NetIC4_T4: IC4.T4(IO_L17P_T2_34) R164.1
NetIC4_U1: IC4.U1(IO_L15N_T2_DQS_34) R159.1
NetIC4_U5: IC4.U5(IO_L20N_T3_34) R162.1
NetIC4_U6: IC4.U6(IO_L20P_T3_34) R161.1
NetIC4_V7: IC4.V7(IO_L24N_T3_34) TP19.1

Not connected (* = marked no-connect by the designer): IC4 J4(IO_L2N_T0_34) J5(IO_L2P_T0_34) J6(IO_0_34) L5(IO_L6P_T0_34) M5(IO_L6N_T0_VREF_34) R7(IO_L22P_T3_34) T7(IO_L22N_T3_34) U7(IO_L23P_T3_34)

### Layout directives
net class 50_Ohm: NetIC4_P6, NetIC4_R5, NetIC4_T4, NetIC4_U1, NetIC4_U5, NetIC4_U6

### Notes on the sheet
- 3.3V
- Project/Equipment
- Document
- Designer
- Drawn by
- Check.by
- Copyright WUT ISE 2024.
  This documentation describes Open Hardware and is licensed under the CERN OHL v.2. You may redistribute and modify this documentation under the terms of the CERN OHL v.2. (http://ohwr.org/CERNOHL). This documentation is distributed WITHOUT ANY EXPRESS OR IMPLIED WARRANTY, INCLUDING OF MERCHANTABILITY, SATISFACTORY QUALITY AND FITNESS FOR A PARTICULAR PURPOSE. Please see the CERN OHL v.2 for applicable conditions.
- Contact
- File
- Last Mod.
- Print Date
- Sheet
- Size
- A3
- of
- Rev
- (in symbol CMP-0383-00003-1, part C) BANK 34

### Library data of the parts
C33 = CC0201_100NF_6.3V_10%_X5R: as C148 on sheet VCXO_25M_PTP; Part Number: CC0201_100NF_6.3V_10%_X5R; Component Kind: Standard; Component Type: Standard; Pin Count: 2; Value: 100nF; Status: Not Recommended; Manufacturer Part Number: CC0201_100NF_6.3V_10%_X5R; Case: 0201; Mounted: Yes; Socket: No; SMD: Yes; Sense: No; Manufacturer1 Example: AVX; Manufacturer1 ComponentHeight: 0.33mm; HelpURL: \\cern.ch\dfs\Applications\Altium\Datasheets\CC0201_X5R_AVX.pdf; Author: CERN DEM JLC; CreateDate: 03.12.2007; LatestRevisionDate: 03.12.2007
IC4 = CMP-0383-00003-1: Artix-7 FPGA, 150 User I/Os, 4 GTP, 324-Ball BGA, Speed Grade 2, Industrial Grade, Pb-Free; Manufacturer: Xilinx; Available User I/O: 150; Speed Grades: 2; GTP: 4; Logic Cells: 33280; Total Block RAM: 1800 Kb; CMTs: 5; ComponentLink3URL: http://www.xilinx.com/support/documentation/user_guides/ug475_7Series_Pkg_Pinout.pdf; Maximum Distributed RAM: 400 Kb; Operating Temperature Range: Industrial; ComponentLink1URL: http://www.xilinx.com/; Mounting Technology: Surface Mount; ComponentLink1Description: Manufacturer URL; ComponentLink2Description: Datasheet; PartNumber: XC7A35T-2CSG325I; PackageVersion: Rev. 1.11; PackageDescription: 324-Ball Wire-Bond Chip-Scale BGA, Body 15 x 15 mm, Pitch 0.8 mm; DatasheetVersion: Rev. 1.15; PackageReference: CSG-325; ComponentLink3Description: Pinout; ComponentLink4Description: Package Specification; ComponentLink2URL: http://www.xilinx.com/support/documentation/data_sheets/ds180_7Series_Overview.pdf; ComponentLink4URL: http://www.xilinx.com/support/documentation/user_guides/ug475_7Series_Pkg_Pinout.pdf
IC38 = 24LC64-I/MS: 64K I2C Serial EEPROM; Part Description: 2.5V-5.5V, 64K (8K x 8-bit) I2C Serial EEPROM; Manufacturer: MICROCHIP TECHNOLOGY; PressFit: No; Bonding: No; Part Number: 24LC64-I/MS; Component Kind: Standard; Component Type: Standard; Device: 24LC64-I/MS; PackageDescription: SOP, 0.65mm pitch; 8 pin, 3.00mm W X 3.00mm L X 1.10mm H body, IPC Medium Density; Manufacturer Part Number: 24LC64-I/MS; Pin Count: 8; Case: MSOP8; Mounted: Yes; Socket: No; SMD: Yes; Sense: No; ComponentHeight: 1.1mm; HelpURL: \\cern.ch\dfs\Applications\Altium\Datasheets\24LC64-I-MS.pdf; Author: CERN DEM JLC; CreateDate: 24.01.2011; LatestRevisionDate: 24.01.2011
R40 R41 = R0402_2K2_1%_0.0625W_100PPM: Resistor - 1%; Part Description: General Purpose Thick Film Chip Resistor; Manufacturer: GENERIC; Manufacturer1 Part Number: 232270672202L; TC: ±100ppm/°C; PressFit: No; Part Number: R0402_2K2_1%_0.0625W_100PPM; Component Kind: Standard; Component Type: Standard; Pin Count: 2; Value: 2k2; Status: Not Recommended; Power: 0.0625W; Tolerance: ±1%; Manufacturer Part Number: R0402_2K2_1%_0.0625W_100PPM; Case: 0402; Mounted: Yes; Sense: No; Socket: No; SMD: Yes; Manufacturer1 Example: YAGEO PHYCOMP; Manufacturer1 ComponentHeight: 0.4mm; HelpURL: \\cern.ch\dfs\Applications\Altium\Datasheets\R0402_Phycomp_RC0402.pdf; Author: CERN DEM JLC; CreateDate: 03.12.2007; LatestRevisionDate: 17.10.2012
R159-R164 = R0402_22R_1%_0.0625W_100PPM: Resistor - 1%; Part Description: General Purpose Thick Film Chip Resistor; Manufacturer: GENERIC; Manufacturer1 Part Number: 232270672209L; TC: ±100ppm/°C; PressFit: No; Part Number: R0402_22R_1%_0.0625W_100PPM; Component Kind: Standard; Component Type: Standard; Pin Count: 2; Value: 22; Status: Not Recommended; Power: 0.0625W; Manufacturer Part Number: R0402_22R_1%_0.0625W_100PPM; Case: 0402; Mounted: Yes; Sense: No; Socket: No; SMD: Yes; Manufacturer1 Example: YAGEO PHYCOMP; Manufacturer1 ComponentHeight: 0.4mm; HelpURL: \\cern.ch\dfs\Applications\Altium\Datasheets\R0402_Phycomp_RC0402.pdf; Author: CERN DEM JLC; CreateDate: 03.12.2007; LatestRevisionDate: 17.10.2012
TP18 TP19 = SMD_PAD_0.6X0.6MM: Part Description: 0.6mm x 0.6mm PCB Copper Area (SMD Test Point); Mounted: No; Part Number: SMD_PAD_0.6X0.6MM; Component Kind: Standard (No BOM); Component Type: Standard (No BOM); Pin Count: 1; Family: Test Point; Socket: No; SMD: Yes; Sense: No; Status: None; ComponentHeight: 0mm; HelpURL: Undefined; Author: CERN DEM HF; CreateDate: 24.05.2023; LatestRevisionDate: 24.05.2023; PackageDescription: 0.6mm x 0.6mm PCB Copper Area (SMD Test Point)